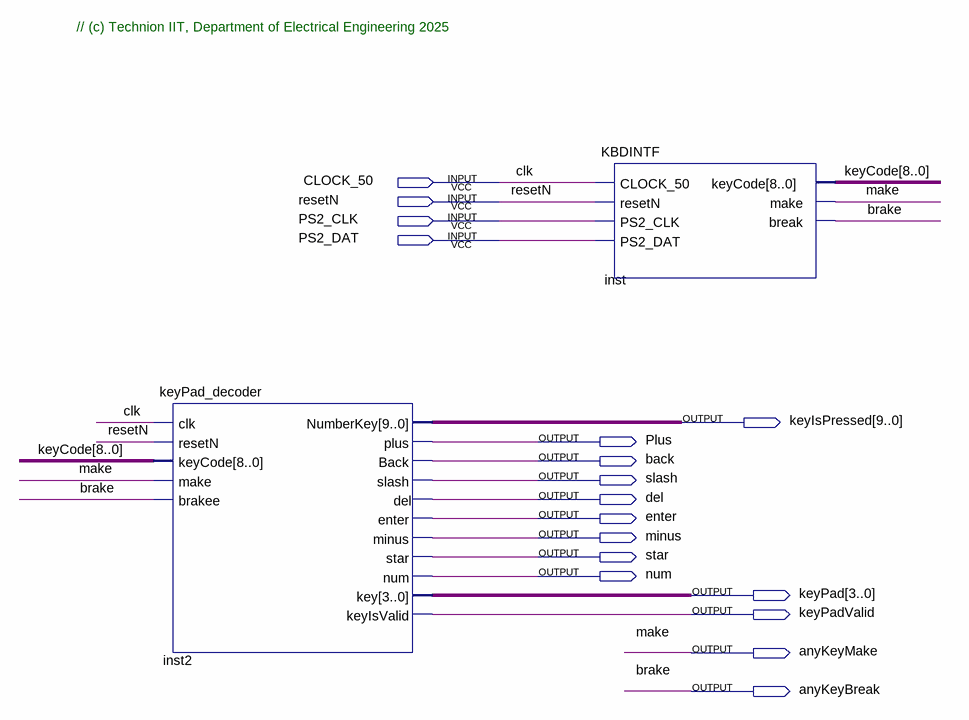
[diagram p0: schematic sheet]
// Quartus schematic TOP_KBD.bdf as structural Verilog: 2 symbols, 17 pins
module TOP_KBD (
  input  CLOCK_50,
  input  resetN,
  input  PS2_CLK,
  input  PS2_DAT,
  output [9:0] keyIsPressed,
  output Plus,
  output back,
  output slash,
  output del,
  output enter,
  output minus,
  output star,
  output num,
  output [3:0] keyPad,
  output keyPadValid,
  output anyKeyMake,
  output anyKeyBreak
);

  wire [8:0] keyCode;

  keyPad_decoder inst2 (
    .clk(CLOCK_50), .resetN(resetN), .keyCode(keyCode), .make(anyKeyMake), .brakee(anyKeyBreak),
    .NumberKey(keyIsPressed), .plus(Plus), .Back(back), .slash(slash), .del(del), .enter(enter),
    .minus(minus), .star(star), .num(num), .key(keyPad), .keyIsValid(keyPadValid));
  KBDINTF inst (
    .CLOCK_50(CLOCK_50), .resetN(resetN), .PS2_CLK(PS2_CLK), .PS2_DAT(PS2_DAT), .keyCode(keyCode),
    .make(anyKeyMake), .\break (anyKeyBreak));

  // Other names for the same wires on the sheet: brake = anyKeyBreak; clk = CLOCK_50; make = anyKeyMake

  // Notes on the sheet:
  //   // (c) Technion IIT, Department of Electrical Engineering 2025
endmodule
